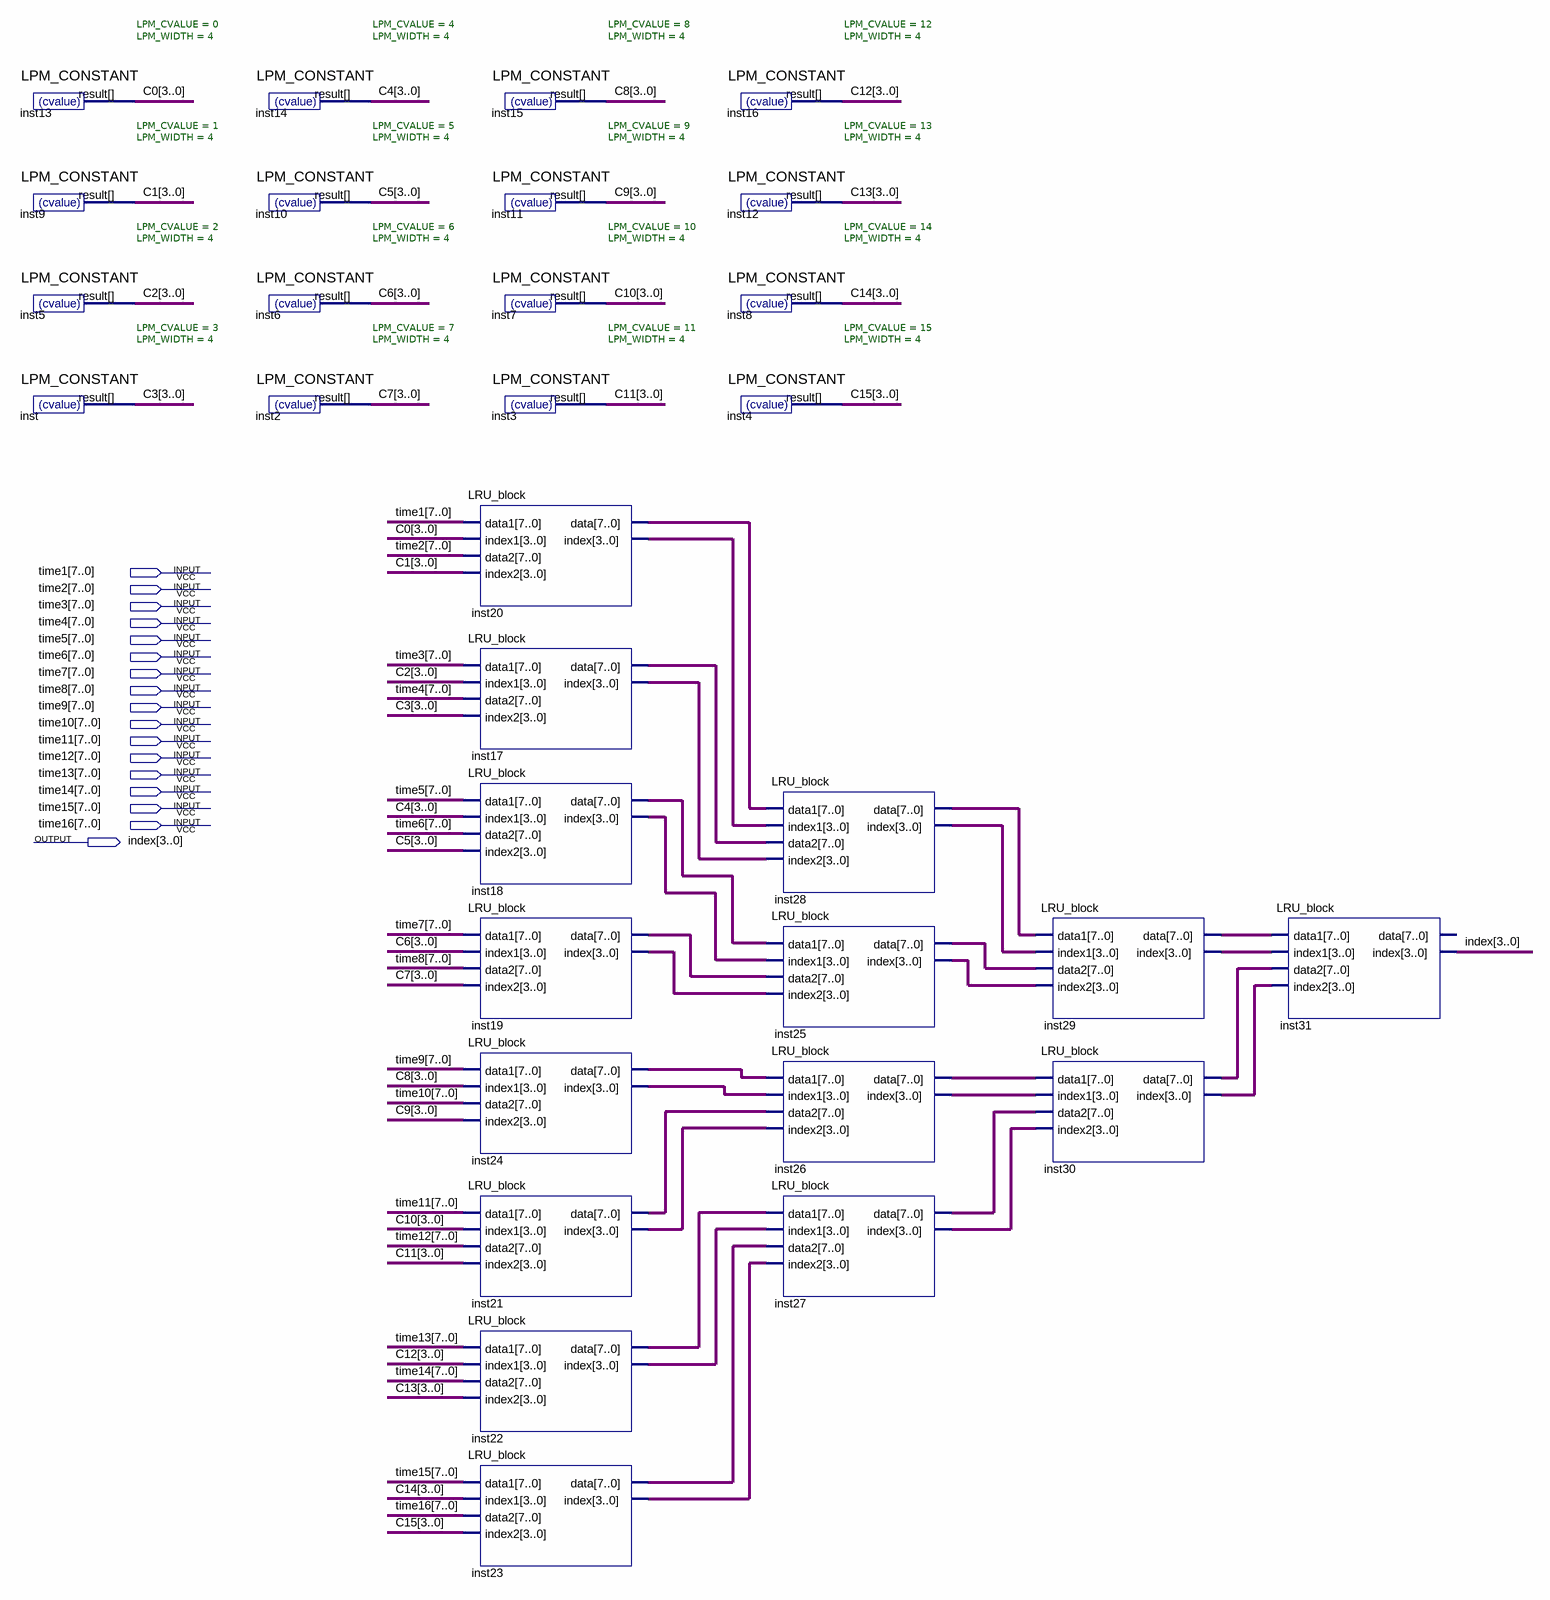
[diagram p0: schematic sheet]
// Quartus schematic LRU.bdf as structural Verilog: 31 symbols, 17 pins
module LRU (
  input  [7:0] time1,
  input  [7:0] time2,
  input  [7:0] time3,
  input  [7:0] time4,
  input  [7:0] time5,
  input  [7:0] time6,
  input  [7:0] time7,
  input  [7:0] time8,
  input  [7:0] time9,
  input  [7:0] time10,
  input  [7:0] time11,
  input  [7:0] time12,
  input  [7:0] time13,
  input  [7:0] time14,
  input  [7:0] time15,
  input  [7:0] time16,
  output [3:0] index
);

  wire [3:0] C0, C1, C2, C3, C4, C5, C6, C7, C8, C9, C10, C11, C12, C13, C14, C15, inst17_index,
       inst18_index, inst19_index, inst20_index, inst21_index, inst22_index, inst23_index, inst24_index,
       inst25_index, inst26_index, inst27_index, inst28_index, inst29_index, inst30_index;
  wire [7:0] inst17_data, inst18_data, inst19_data, inst20_data, inst21_data, inst22_data, inst23_data,
       inst24_data, inst25_data, inst26_data, inst27_data, inst28_data, inst29_data, inst30_data;

  LPM_CONSTANT #(.LPM_CVALUE(0), .LPM_WIDTH(4)) inst13 (.result(C0));
  LPM_CONSTANT #(.LPM_CVALUE(1), .LPM_WIDTH(4)) inst9 (.result(C1));
  LPM_CONSTANT #(.LPM_CVALUE(2), .LPM_WIDTH(4)) inst5 (.result(C2));
  LPM_CONSTANT #(.LPM_CVALUE(3), .LPM_WIDTH(4)) inst (.result(C3));
  LPM_CONSTANT #(.LPM_CVALUE(4), .LPM_WIDTH(4)) inst14 (.result(C4));
  LPM_CONSTANT #(.LPM_CVALUE(5), .LPM_WIDTH(4)) inst10 (.result(C5));
  LPM_CONSTANT #(.LPM_CVALUE(6), .LPM_WIDTH(4)) inst6 (.result(C6));
  LPM_CONSTANT #(.LPM_CVALUE(7), .LPM_WIDTH(4)) inst2 (.result(C7));
  LPM_CONSTANT #(.LPM_CVALUE(8), .LPM_WIDTH(4)) inst15 (.result(C8));
  LPM_CONSTANT #(.LPM_CVALUE(9), .LPM_WIDTH(4)) inst11 (.result(C9));
  LPM_CONSTANT #(.LPM_CVALUE(10), .LPM_WIDTH(4)) inst7 (.result(C10));
  LPM_CONSTANT #(.LPM_CVALUE(11), .LPM_WIDTH(4)) inst3 (.result(C11));
  LRU_block inst20 (.data1(time1), .index1(C0), .data2(time2), .index2(C1), .data(inst20_data), .index(inst20_index));
  LRU_block inst17 (.data1(time3), .index1(C2), .data2(time4), .index2(C3), .data(inst17_data), .index(inst17_index));
  LRU_block inst18 (.data1(time5), .index1(C4), .data2(time6), .index2(C5), .data(inst18_data), .index(inst18_index));
  LRU_block inst19 (.data1(time7), .index1(C6), .data2(time8), .index2(C7), .data(inst19_data), .index(inst19_index));
  LRU_block inst24 (.data1(time9), .index1(C8), .data2(time10), .index2(C9), .data(inst24_data), .index(inst24_index));
  LRU_block inst21 (
    .data1(time11), .index1(C10), .data2(time12), .index2(C11), .data(inst21_data), .index(inst21_index));
  LRU_block inst22 (
    .data1(time13), .index1(C12), .data2(time14), .index2(C13), .data(inst22_data), .index(inst22_index));
  LRU_block inst23 (
    .data1(time15), .index1(C14), .data2(time16), .index2(C15), .data(inst23_data), .index(inst23_index));
  LPM_CONSTANT #(.LPM_CVALUE(12), .LPM_WIDTH(4)) inst16 (.result(C12));
  LPM_CONSTANT #(.LPM_CVALUE(13), .LPM_WIDTH(4)) inst12 (.result(C13));
  LPM_CONSTANT #(.LPM_CVALUE(14), .LPM_WIDTH(4)) inst8 (.result(C14));
  LPM_CONSTANT #(.LPM_CVALUE(15), .LPM_WIDTH(4)) inst4 (.result(C15));
  LRU_block inst28 (
    .data1(inst20_data), .index1(inst20_index), .data2(inst17_data), .index2(inst17_index),
    .data(inst28_data), .index(inst28_index));
  LRU_block inst25 (
    .data1(inst18_data), .index1(inst18_index), .data2(inst19_data), .index2(inst19_index),
    .data(inst25_data), .index(inst25_index));
  LRU_block inst26 (
    .data1(inst24_data), .index1(inst24_index), .data2(inst21_data), .index2(inst21_index),
    .data(inst26_data), .index(inst26_index));
  LRU_block inst27 (
    .data1(inst22_data), .index1(inst22_index), .data2(inst23_data), .index2(inst23_index),
    .data(inst27_data), .index(inst27_index));
  LRU_block inst29 (
    .data1(inst28_data), .index1(inst28_index), .data2(inst25_data), .index2(inst25_index),
    .data(inst29_data), .index(inst29_index));
  LRU_block inst30 (
    .data1(inst26_data), .index1(inst26_index), .data2(inst27_data), .index2(inst27_index),
    .data(inst30_data), .index(inst30_index));
  LRU_block inst31 (
    .data1(inst29_data), .index1(inst29_index), .data2(inst30_data), .index2(inst30_index), .index(index));  // open: data
endmodule
